# Altium project Heart-by-LED.PrjPCB
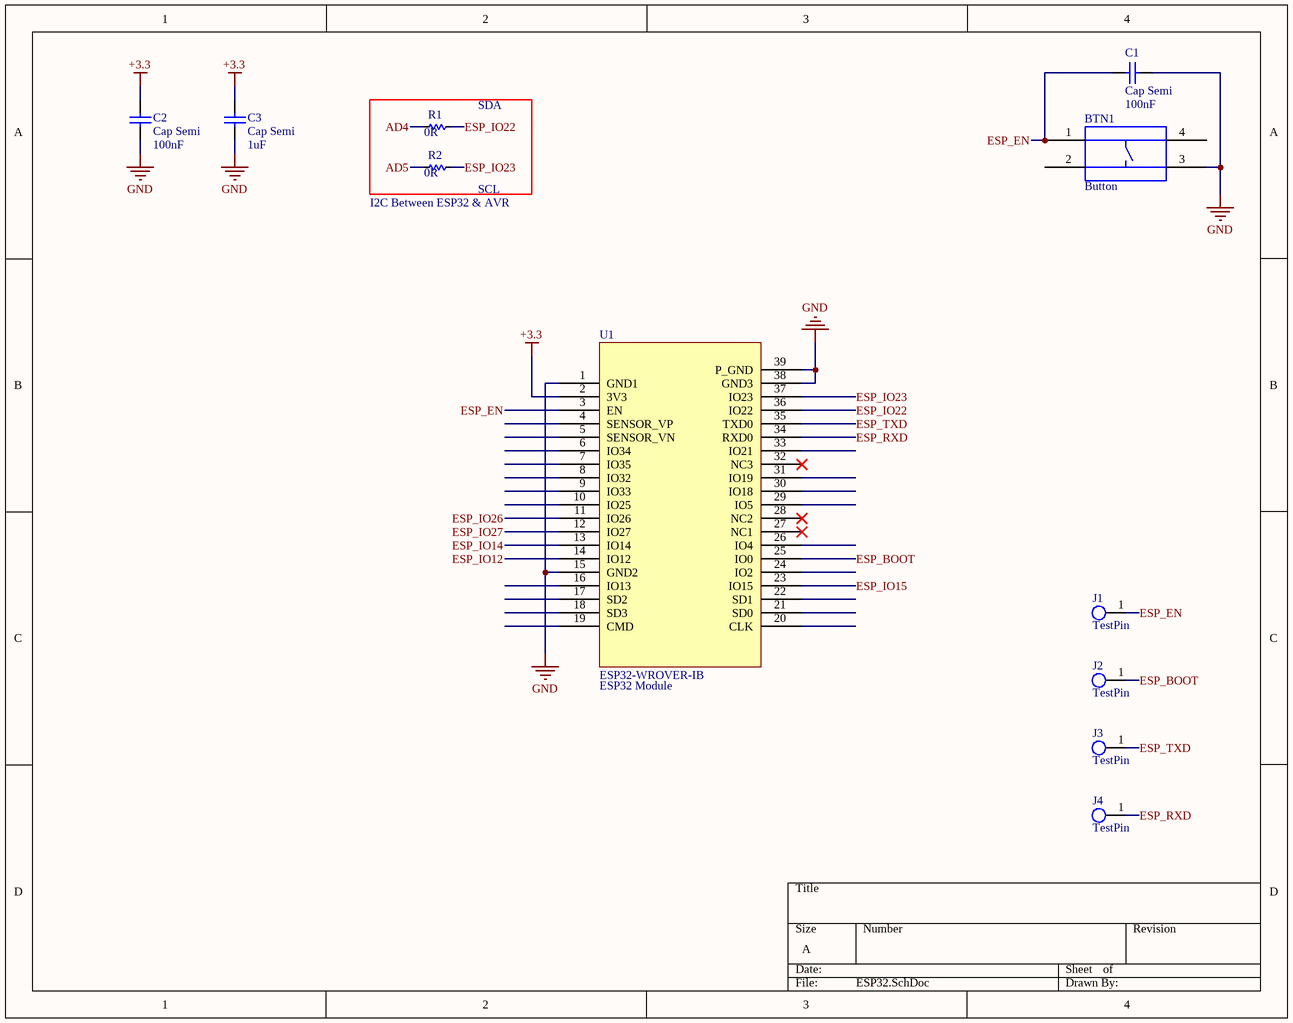
[diagram p0: ESP32.SchDoc]
3 sheets, 94 parts. Net scope: global (net labels, ports and power ports of the same name join across sheets).
Board file: Heart-by-LED.PcbDoc
Sheets:
  ESP32.SchDoc
  WS2812B.SchDoc
  LEDs.SchDoc

## Sheet ESP32.SchDoc
size A

### Parts
BTN1  Button  [TactileButton_4x4]
C1  Cap Semi  value 100nF  [1608[0603]]
C2  Cap Semi  value 100nF  [1608[0603]]
C3  Cap Semi  value 1uF  [1608[0603]]
J1  TestPin  [TestPin_1mm]
J2  TestPin  [TestPin_1mm]
J3  TestPin  [TestPin_1mm]
J4  TestPin  [TestPin_1mm]
R1  value 0R  [RES-SMD-0603]  (hidden comment: Res)
R2  value 0R  [RES-SMD-0603]  (hidden comment: Res)
U1  ESP32 Module  [ESP32-WROVER-IB]

### Nets
+3.3: C2.2 C3.2 U1.2(3V3)
GND: BTN1.3(Pin3) C1.1 C2.1 C3.1 U1.1(GND1) U1.15(GND2) U1.38(GND3) U1.39(P_GND)
AD4: R1.2
AD5: R2.2
ESP_BOOT: J2.1 U1.25(IO0)
ESP_EN: BTN1.1(Pin1) C1.2 J1.1 U1.3(EN)
ESP_IO12: U1.14(IO12)
ESP_IO14: U1.13(IO14)
ESP_IO15: U1.23(IO15)
ESP_IO22: R1.1 U1.36(IO22)
ESP_IO23: R2.1 U1.37(IO23)
ESP_IO26: U1.11(IO26)
ESP_IO27: U1.12(IO27)
ESP_RXD: J4.1 U1.34(RXD0)
ESP_TXD: J3.1 U1.35(TXD0)

Not connected (* = marked no-connect by the designer): BTN1 2(Pin2) 4(Pin4); U1 4(SENSOR_VP) 5(SENSOR_VN) 6(IO34) 7(IO35) 8(IO32) 9(IO33) 10(IO25) 16(IO13) 17(SD2) 18(SD3) 19(CMD) 20(CLK) 21(SD0) 22(SD1) 24(IO2) 26(IO4) 27(NC1)* 28(NC2)* 29(IO5) 30(IO18) 31(IO19) 32(NC3)* 33(IO21)

### Notes on the sheet
- (near R1) SDA
- (near R2) I2C Between ESP32 & AVR
- (near R2) SCL

### Library data of the parts
BTN1 = Tactile_4x4
C1-C3 = Cap Semi: Capacitor (Semiconductor SIM Model); Published: 8-Jun-2000; LatestRevisionDate: 29-May-2009; LatestRevisionNote: IPC-7351 Footprint Added.; PackageReference: C1206; Publisher: Altium Limited; PackageDescription: Chip Capacitor
J1-J4 = TestPin_1mm: Test conntact for pogo pins
R1 R2 = Res-SMD: Resistor; Manufacturer: Generic Components; Class: Passive; Published: 08/06/2000; Publisher: Altium Hobart Technology Centre
U1 = ESP32-WROVER-IB: Multiprotocol Modules SMD Module M213DH3264UH3Q0, ESP32-D0WD, 64Mbits PSRAM, 4 MB SPI flash, IPEX Antenna connector; Manufacturer: Espressif Systems; Value: ESP32-WROVER-IB

## Sheet WS2812B.SchDoc
size A
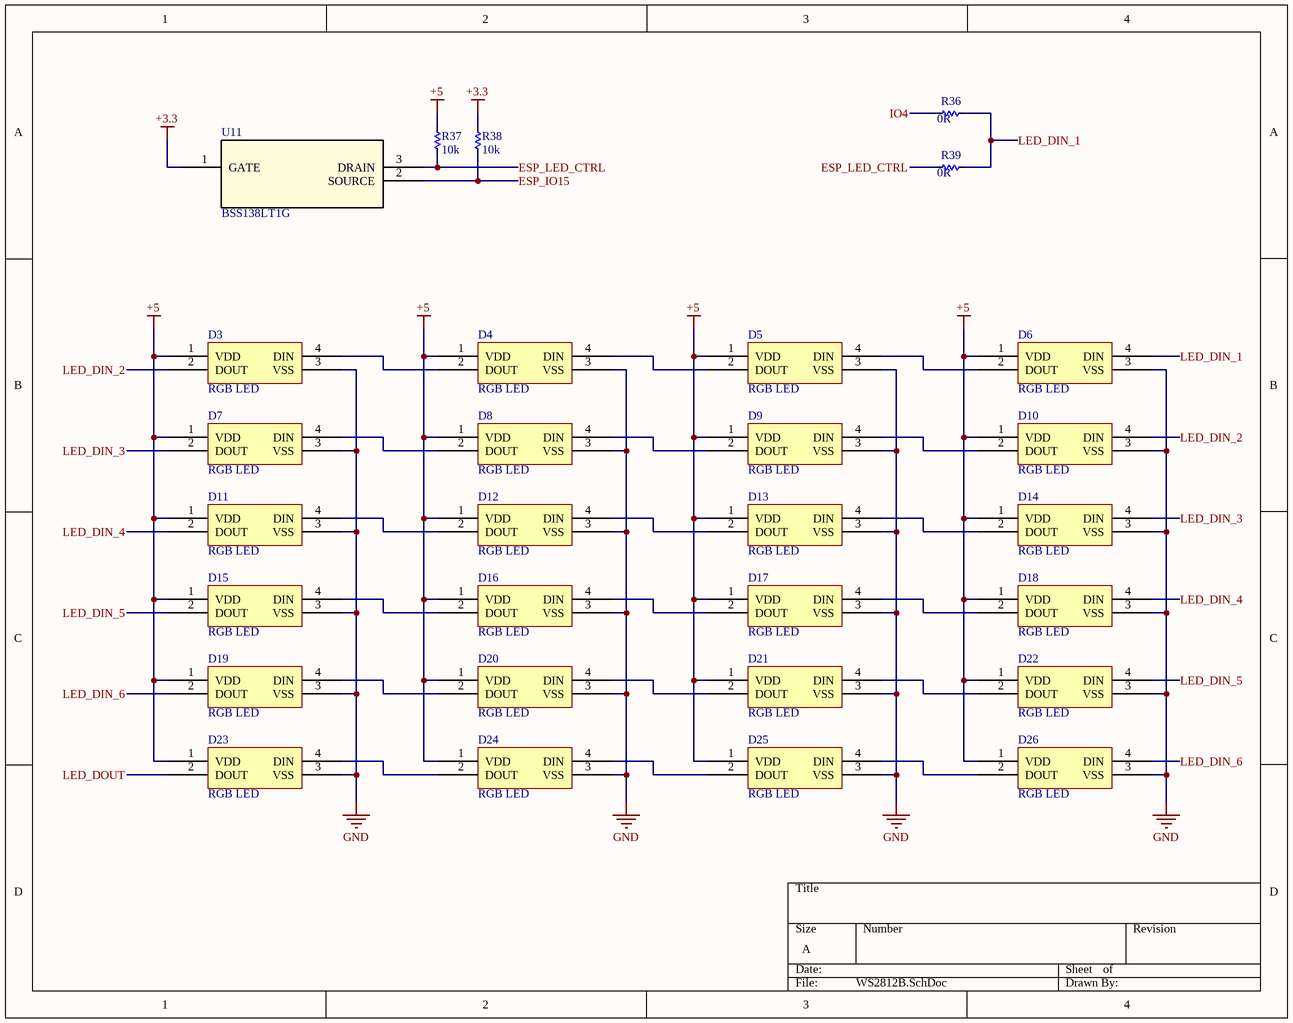
[diagram p1: WS2812B.SchDoc]

### Parts
D3  RGB LED  [WS2812B]
D4  RGB LED  [WS2812B]
D5  RGB LED  [WS2812B]
D6  RGB LED  [WS2812B]
D7  RGB LED  [WS2812B]
D8  RGB LED  [WS2812B]
D9  RGB LED  [WS2812B]
D10  RGB LED  [WS2812B]
D11  RGB LED  [WS2812B]
D12  RGB LED  [WS2812B]
D13  RGB LED  [WS2812B]
D14  RGB LED  [WS2812B]
D15  RGB LED  [WS2812B]
D16  RGB LED  [WS2812B]
D17  RGB LED  [WS2812B]
D18  RGB LED  [WS2812B]
D19  RGB LED  [WS2812B]
D20  RGB LED  [WS2812B]
D21  RGB LED  [WS2812B]
D22  RGB LED  [WS2812B]
D23  RGB LED  [WS2812B]
D24  RGB LED  [WS2812B]
D25  RGB LED  [WS2812B]
D26  RGB LED  [WS2812B]
R36  value 0R  [RES-SMD-0603]  (hidden comment: Res)
R37  value 10k  [RES-SMD-0603]  (hidden comment: Res)
R38  value 10k  [RES-SMD-0603]  (hidden comment: Res)
R39  value 0R  [RES-SMD-0603]  (hidden comment: Res)
U11  BSS138LT1G  [SOT23-3_ONS]

### Nets
+3.3: R38.1 U11.1(GATE)
+5: D3.1(VDD) D4.1(VDD) D5.1(VDD) D6.1(VDD) D7.1(VDD) D8.1(VDD) D9.1(VDD) D10.1(VDD) D11.1(VDD) D12.1(VDD) D13.1(VDD) D14.1(VDD) D15.1(VDD) D16.1(VDD) D17.1(VDD) D18.1(VDD) D19.1(VDD) D20.1(VDD) D21.1(VDD) D22.1(VDD) D23.1(VDD) D24.1(VDD) D25.1(VDD) D26.1(VDD) R37.1
GND: D3.3(VSS) D4.3(VSS) D5.3(VSS) D6.3(VSS) D7.3(VSS) D8.3(VSS) D9.3(VSS) D10.3(VSS) D11.3(VSS) D12.3(VSS) D13.3(VSS) D14.3(VSS) D15.3(VSS) D16.3(VSS) D17.3(VSS) D18.3(VSS) D19.3(VSS) D20.3(VSS) D21.3(VSS) D22.3(VSS) D23.3(VSS) D24.3(VSS) D25.3(VSS) D26.3(VSS)
ESP_IO15: R38.2 U11.2(SOURCE)
ESP_LED_CTRL: R37.2 R39.2 U11.3(DRAIN)
IO4: R36.2
LED_DIN_1: D6.4(DIN) R36.1 R39.1
LED_DIN_2: D3.2(DOUT) D10.4(DIN)
LED_DIN_3: D7.2(DOUT) D14.4(DIN)
LED_DIN_4: D11.2(DOUT) D18.4(DIN)
LED_DIN_5: D15.2(DOUT) D22.4(DIN)
LED_DIN_6: D19.2(DOUT) D26.4(DIN)
LED_DOUT: D23.2(DOUT)
NetD3_4: D3.4(DIN) D4.2(DOUT)
NetD4_4: D4.4(DIN) D5.2(DOUT)
NetD5_4: D5.4(DIN) D6.2(DOUT)
NetD7_4: D7.4(DIN) D8.2(DOUT)
NetD8_4: D8.4(DIN) D9.2(DOUT)
NetD9_4: D9.4(DIN) D10.2(DOUT)
NetD11_4: D11.4(DIN) D12.2(DOUT)
NetD12_4: D12.4(DIN) D13.2(DOUT)
NetD13_4: D13.4(DIN) D14.2(DOUT)
NetD15_4: D15.4(DIN) D16.2(DOUT)
NetD16_4: D16.4(DIN) D17.2(DOUT)
NetD17_4: D17.4(DIN) D18.2(DOUT)
NetD19_4: D19.4(DIN) D20.2(DOUT)
NetD20_4: D20.4(DIN) D21.2(DOUT)
NetD21_4: D21.4(DIN) D22.2(DOUT)
NetD23_4: D23.4(DIN) D24.2(DOUT)
NetD24_4: D24.4(DIN) D25.2(DOUT)
NetD25_4: D25.4(DIN) D26.2(DOUT)

### Library data of the parts
D3-D26 = WS2812B: RGB 620~630nm Red, 515~530nm Green, 465~475nm Blue SMD,5x5mm Light Emitting Diodes (LED) ROHS; Manufacturer: Worldsemi; Value: WS2812B
R36-R39 = Res-SMD: as R1 on sheet ESP32; Published: 08/06/2000; Publisher: Altium Hobart Technology Centre
U11 = BSS138LT1G: No Description Available; Vendor: ON Semiconductor; Built_By: EMA_Jessica; SourceLibrary: ON_Semiconductor_2019-12-30; Manufacturer_Part_Number: BSS138LT1G; Copyright: Copyright (C) 2018 Accelerated Designs. All rights reserved; RefDes: RefDes; Type: DEV

## Sheet LEDs.SchDoc
size A
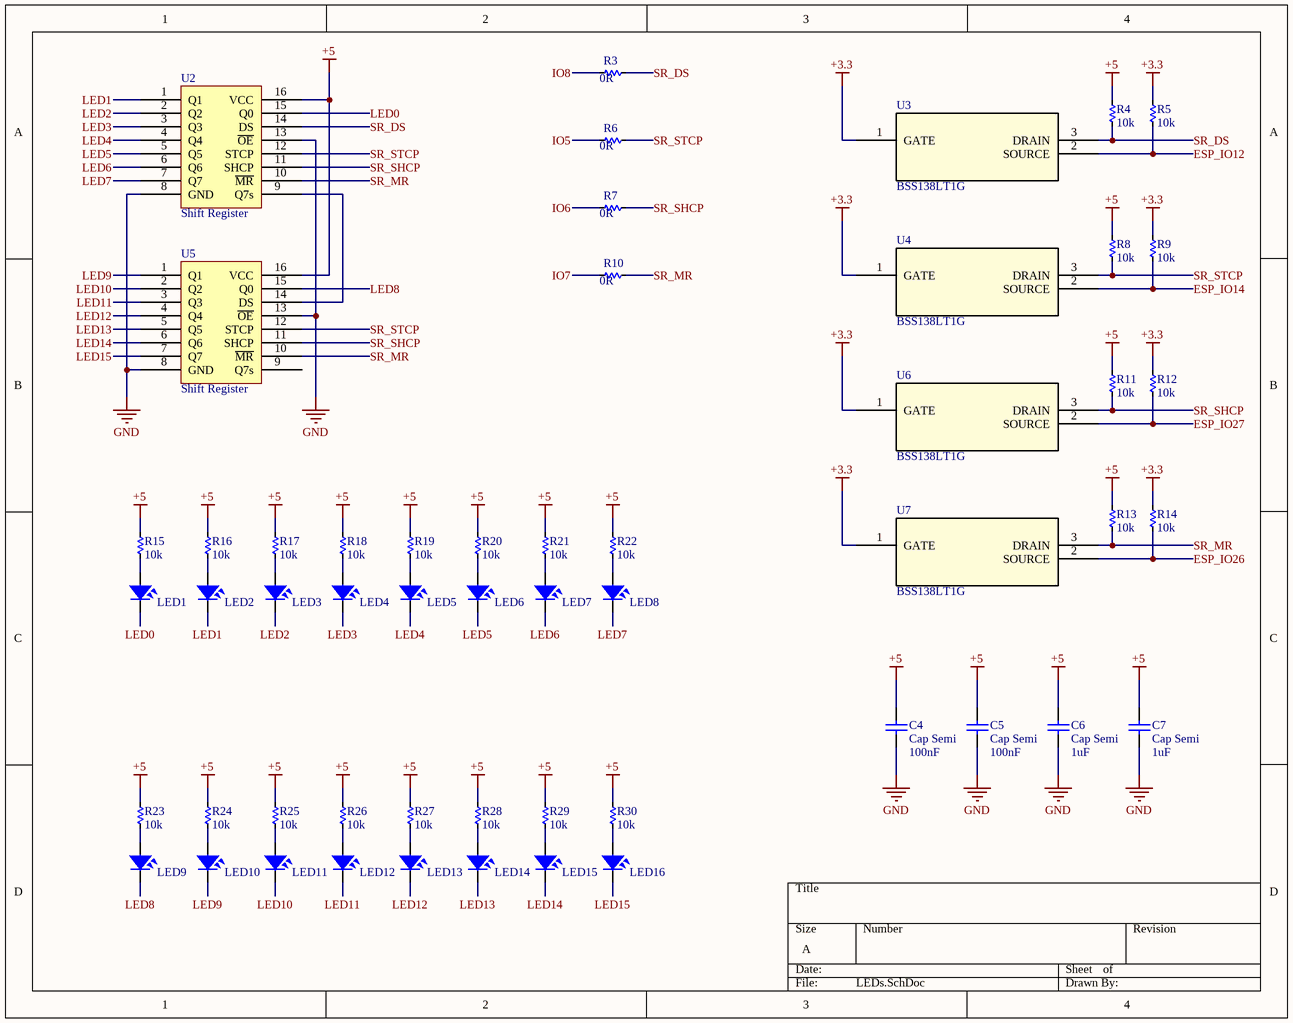
[diagram p2: LEDs.SchDoc]

### Parts
C4  Cap Semi  value 100nF  [1608[0603]]
C5  Cap Semi  value 100nF  [1608[0603]]
C6  Cap Semi  value 1uF  [1608[0603]]
C7  Cap Semi  value 1uF  [1608[0603]]
LED1  LED  [LED-0805-Red]  (value not drawn)
LED2  LED  [LED-0805-Red]  (value not drawn)
LED3  LED  [LED-0805-Red]  (value not drawn)
LED4  LED  [LED-0805-Red]  (value not drawn)
LED5  LED  [LED-0805-Red]  (value not drawn)
LED6  LED  [LED-0805-Red]  (value not drawn)
LED7  LED  [LED-0805-Red]  (value not drawn)
LED8  LED  [LED-0805-Red]  (value not drawn)
LED9  LED  [LED-0805-Red]  (value not drawn)
LED10  LED  [LED-0805-Red]  (value not drawn)
LED11  LED  [LED-0805-Red]  (value not drawn)
LED12  LED  [LED-0805-Red]  (value not drawn)
LED13  LED  [LED-0805-Red]  (value not drawn)
LED14  LED  [LED-0805-Red]  (value not drawn)
LED15  LED  [LED-0805-Red]  (value not drawn)
LED16  LED  [LED-0805-Red]  (value not drawn)
R3  value 0R  [RES-SMD-0603]  (hidden comment: Res)
R4  value 10k  [RES-SMD-0603]  (hidden comment: Res)
R5  value 10k  [RES-SMD-0603]  (hidden comment: Res)
R6  value 0R  [RES-SMD-0603]  (hidden comment: Res)
R7  value 0R  [RES-SMD-0603]  (hidden comment: Res)
R8  value 10k  [RES-SMD-0603]  (hidden comment: Res)
R9  value 10k  [RES-SMD-0603]  (hidden comment: Res)
R10  value 0R  [RES-SMD-0603]  (hidden comment: Res)
R11  value 10k  [RES-SMD-0603]  (hidden comment: Res)
R12  value 10k  [RES-SMD-0603]  (hidden comment: Res)
R13  value 10k  [RES-SMD-0603]  (hidden comment: Res)
R14  value 10k  [RES-SMD-0603]  (hidden comment: Res)
R15  value 10k  [RES-SMD-0603]  (hidden comment: Res)
R16  value 10k  [RES-SMD-0603]  (hidden comment: Res)
R17  value 10k  [RES-SMD-0603]  (hidden comment: Res)
R18  value 10k  [RES-SMD-0603]  (hidden comment: Res)
R19  value 10k  [RES-SMD-0603]  (hidden comment: Res)
R20  value 10k  [RES-SMD-0603]  (hidden comment: Res)
R21  value 10k  [RES-SMD-0603]  (hidden comment: Res)
R22  value 10k  [RES-SMD-0603]  (hidden comment: Res)
R23  value 10k  [RES-SMD-0603]  (hidden comment: Res)
R24  value 10k  [RES-SMD-0603]  (hidden comment: Res)
R25  value 10k  [RES-SMD-0603]  (hidden comment: Res)
R26  value 10k  [RES-SMD-0603]  (hidden comment: Res)
R27  value 10k  [RES-SMD-0603]  (hidden comment: Res)
R28  value 10k  [RES-SMD-0603]  (hidden comment: Res)
R29  value 10k  [RES-SMD-0603]  (hidden comment: Res)
R30  value 10k  [RES-SMD-0603]  (hidden comment: Res)
U2  Shift Register  [SO16]
U3  BSS138LT1G  [SOT23-3_ONS]
U4  BSS138LT1G  [SOT23-3_ONS]
U5  Shift Register  [SO16]
U6  BSS138LT1G  [SOT23-3_ONS]
U7  BSS138LT1G  [SOT23-3_ONS]

### Nets
+3.3: R5.1 R9.1 R12.1 R14.1 U3.1(GATE) U4.1(GATE) U6.1(GATE) U7.1(GATE)
+5: C4.1 C5.1 C6.1 C7.1 R4.1 R8.1 R11.1 R13.1 R15.1 R16.1 R17.1 R18.1 R19.1 R20.1 R21.1 R22.1 R23.1 R24.1 R25.1 R26.1 R27.1 R28.1 R29.1 R30.1 U2.16(VCC) U5.16(VCC)
GND: C4.2 C5.2 C6.2 C7.2 U2.8(GND) U2.13(~{OE}) U5.8(GND) U5.13(~{OE})
ESP_IO12: R5.2 U3.2(SOURCE)
ESP_IO14: R9.2 U4.2(SOURCE)
ESP_IO26: R14.2 U7.2(SOURCE)
ESP_IO27: R12.2 U6.2(SOURCE)
IO5: R6.2
IO6: R7.2
IO7: R10.2
IO8: R3.2
LED0: LED1.2 U2.15(Q0)
LED1: LED2.2 U2.1(Q1)
LED2: LED3.2 U2.2(Q2)
LED3: LED4.2 U2.3(Q3)
LED4: LED5.2 U2.4(Q4)
LED5: LED6.2 U2.5(Q5)
LED6: LED7.2 U2.6(Q6)
LED7: LED8.2 U2.7(Q7)
LED8: LED9.2 U5.15(Q0)
LED9: LED10.2 U5.1(Q1)
LED10: LED11.2 U5.2(Q2)
LED11: LED12.2 U5.3(Q3)
LED12: LED13.2 U5.4(Q4)
LED13: LED14.2 U5.5(Q5)
LED14: LED15.2 U5.6(Q6)
LED15: LED16.2 U5.7(Q7)
SR_DS: R3.1 R4.2 U2.14(DS) U3.3(DRAIN)
SR_MR: R10.1 R13.2 U2.10(~{MR}) U5.10(~{MR}) U7.3(DRAIN)
SR_SHCP: R7.1 R11.2 U2.11(SHCP) U5.11(SHCP) U6.3(DRAIN)
SR_STCP: R6.1 R8.2 U2.12(STCP) U4.3(DRAIN) U5.12(STCP)
NetLED1_1: LED1.1 R15.2
NetLED2_1: LED2.1 R16.2
NetLED3_1: LED3.1 R17.2
NetLED4_1: LED4.1 R18.2
NetLED5_1: LED5.1 R19.2
NetLED6_1: LED6.1 R20.2
NetLED7_1: LED7.1 R21.2
NetLED8_1: LED8.1 R22.2
NetLED9_1: LED9.1 R23.2
NetLED10_1: LED10.1 R24.2
NetLED11_1: LED11.1 R25.2
NetLED12_1: LED12.1 R26.2
NetLED13_1: LED13.1 R27.2
NetLED14_1: LED14.1 R28.2
NetLED15_1: LED15.1 R29.2
NetLED16_1: LED16.1 R30.2
NetU2_9: U2.9(Q7s) U5.14(DS)

Not connected (* = marked no-connect by the designer): U5 9(Q7s)

### Library data of the parts
C4-C7 = Cap Semi: Capacitor (Semiconductor SIM Model); Published: 8-Jun-2000; LatestRevisionDate: 29-May-2009; LatestRevisionNote: IPC-7351 Footprint Added.; PackageReference: C1206; Publisher: Altium Limited; PackageDescription: Chip Capacitor
LED1-LED16 = LED SMD: Value: LED 3 - 5 ly 2 Colour
R3-R30 = Res-SMD: as R1 on sheet ESP32; Published: 08/06/2000; Publisher: Altium Hobart Technology Centre
U2 U5 = 74HC595: 74HC Shift Register SOIC-16_150mil Registers ROHS; Value: 74HC595D
U3 U4 U6 U7 = BSS138LT1G: as U11 on sheet WS2812B; Manufacturer_Part_Number: BSS138LT1G; Copyright: Copyright (C) 2018 Accelerated Designs. All rights reserved; RefDes: RefDes; Type: DEV

## Nets that join several sheets
+3.3: ESP32 (C2.2 C3.2 U1.2), WS2812B (R38.1 U11.1), LEDs (8 pins)
+5: WS2812B (25 pins), LEDs (26 pins)
GND: ESP32 (8 pins), WS2812B (24 pins), LEDs (8 pins)
ESP_IO12: ESP32 (U1.14), LEDs (R5.2 U3.2)
ESP_IO14: ESP32 (U1.13), LEDs (R9.2 U4.2)
ESP_IO15: ESP32 (U1.23), WS2812B (R38.2 U11.2)
ESP_IO26: ESP32 (U1.11), LEDs (R14.2 U7.2)
ESP_IO27: ESP32 (U1.12), LEDs (R12.2 U6.2)